# Altium schematic sheet Tiresias_logic.SchDoc: Tiresias Logic
size 393 x 281 mm; Author: João Victor Colombari Carlet; CompanyName: GMETA; DrawnBy: João Victor Colombari Carlet; Organization: GMETA; Address1: EESC - USP; Address2: 400, Trabalhador São-Carlense Av.; Address3: 13566-590, São Carlos; Address4: São Paulo, Brazil; Revision: 1.0; SheetNumber: 2; SheetTotal: 2; Address_Website: http://www.sel.eesc.usp.br/jcarmo/metamaterials/
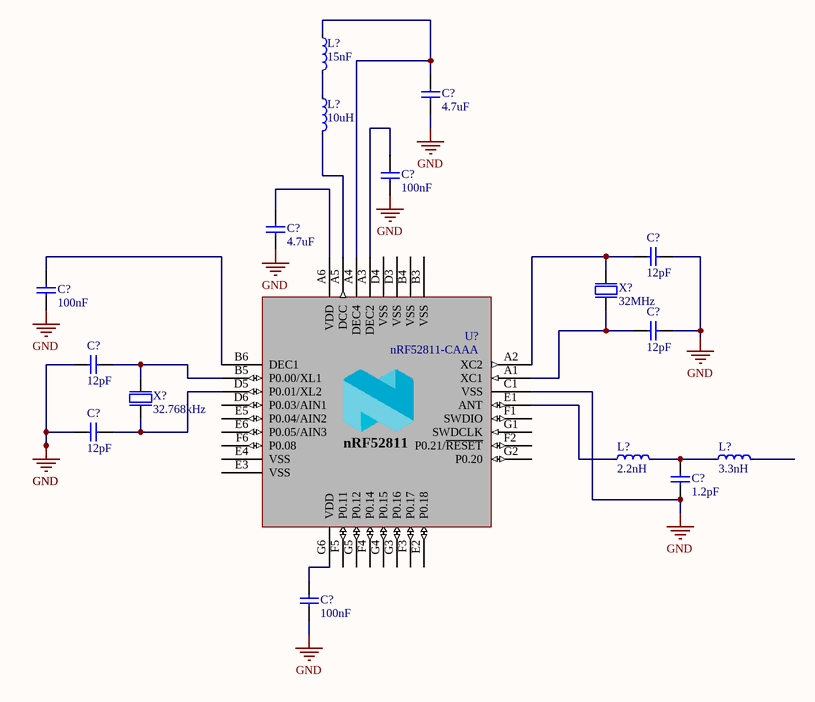
[diagram p0: Tiresias_logic.SchDoc]

## Parts
(Parts that share a designator on the sheet are numbered #1, #2 ... from top to bottom, then left to right.)
C?#1  4.7uF  [CAPC1608X06L]
C?#2  100nF  [CAPC0603X03L_C]
C?#3  4.7uF  [CAPC1608X06L]
C?#4  12pF  [CAPC0603X03L_C]
C?#5  100nF  [CAPC0603X03L_C]
C?#6  12pF  [CAPC0603X03L_C]
C?#7  12pF  [CAPC0603X03L_C]
C?#8  12pF  [CAPC0603X03L_C]
C?#9  1.2pF  [CAPC0603X03L_C]
C?#10  100nF  [CAPC0603X03L_C]
L?#1  15nF  [INDC1005X04L]
L?#2  10uH  [INDC1608X06L]
L?#3  2.2nH  [INDC0603X03L_C]
L?#4  3.3nH  [INDC0603X03L_C]
U?  nRF52811-CAAA  [BGA33C40P6X6_247X246X50]
X?#1  32MHz  [BT-XTAL_2016]
X?#2  32.768kHz  [XTAL_2012]

## Nets
GND: C?#1.2 C?#2.1 C?#3.2 C?#4.2 C?#5.2 C?#6.2 C?#7.1 C?#8.1 C?#9.2 C?#10.2 U?.C1(VSS) X?#1.2(GND) X?#1.4(GND)
NetC?#1_1: C?#1.1 L?#1.1 U?.A4(DEC4)
NetC?#2_2: C?#2.2 U?.A3(DEC2)
NetC?#3_1: C?#3.1 U?.A6(VDD)
NetC?#4_1: C?#4.1 U?.A2(XC2) X?#1.3(out)
NetC?#5_1: C?#5.1 U?.B6(DEC1)
NetC?#6_1: C?#6.1 U?.A1(XC1) X?#1.1(inp)
NetC?#7_2: C?#7.2 U?.B5(P0.00/XL1) X?#2.1(inp)
NetC?#8_2: C?#8.2 U?.D5(P0.01/XL2) X?#2.2(out)
NetC?#9_1: C?#9.1 L?#3.2 L?#4.1
NetC?#10_1: C?#10.1 U?.G6(VDD)
NetL?#1_2: L?#1.2 L?#2.1
NetL?#2_2: L?#2.2 U?.A5(DCC)
NetL?#3_1: L?#3.1 U?.E1(ANT)

Not connected (* = marked no-connect by the designer): L?#4 2; U? B3(VSS) B4(VSS) D3(VSS) D4(VSS) D6(P0.03/AIN1) E2(P0.18) E3(VSS) E4(VSS) E5(P0.04/AIN2) E6(P0.05/AIN3) F1(SWDIO) F2(P0.21/~{RESET}) F3(P0.17) F4(P0.14) F5(P0.11) F6(P0.08) G1(SWDCLK) G2(P0.20) G3(P0.16) G4(P0.15) G5(P0.12)

## Notes on the sheet
- Title:
- Drawn By:
- Size:
- Date:
- File:
- A3
- Number:
- Time:
- Revision:
- Sheet
- of
- Website:
- (in symbol nRF52811_CAAA) nRF52811

## Library data of the parts
C?#1 C?#3 = CAP_0603_4_7uF: Capacitor, X5R, ±10%; Part Number: C0603-4µ7; Class: SMT; Manufacturer: *; Manufacturer Part Number: *; LatestRevisionDate: 2024/02/20; Value: 4.7uF; Package: 0603; Pin Count: 2
C?#2 C?#5 C?#10 = CAP_0201_100nF: Capacitor, NP0, ±2%; Part Number: C0201-100n; Class: SMT; Manufacturer: *; Manufacturer Part Number: *; LatestRevisionDate: 2024/02/20; Value: 100nF; Package: 0201; Pin Count: 2; JLCpcb link: *; Mouser link: *; DigiKey link: *
C?#4 C?#6-C?#8 = CAP_0201_12pF: Capacitor, NP0, ±2%; Part Number: C0201-12p; Class: SMT; Manufacturer: *; Manufacturer Part Number: *; LatestRevisionDate: 2017-11-09; Value: 12pF; Package: 0201; Pin Count: 2; JLCpcb link: *; Mouser link: *; DigiKey link: *
C?#9 = CAP_0201_1p2F: Capacitor, NP0, ±2%; Part Number: C0201-1p2; Class: SMT; Manufacturer: *; Manufacturer Part Number: *; LatestRevisionDate: 2024/02/20; Value: 1.2pF; Package: 0201; Pin Count: 2; JLCpcb link: *; Mouser link: *; DigiKey link: *
L?#1 = IND_0402_15nF: High frequency chip inductor ±10%; Part Number: L0402-15n; Class: SMT; LatestRevisionDate: 2024/02/20; Value: 15nF; Package: 0402; Pin Count: 2
L?#2 = IND_0603_10uH: Chip inductor, IDC,min = 50 mA, ±20%; Part Number: L0603-10µ; Class: SMT; LatestRevisionDate: 2024/02/20; Value: 10uH; Package: 0603; Pin Count: 2
L?#3 = IND_0201_2n2H: High frequency chip inductor ±5%; Part Number: L0201-2n2; Class: SMT; Manufacturer: *; Manufacturer Part Number: *; LatestRevisionDate: 2024/02/20; Value: 2.2nH; Package: 0201; Pin Count: 2
L?#4 = IND_0201_3n3H: High frequency chip inductor ±5%; Part Number: L0201-3n3; Class: SMT; Manufacturer: *; Manufacturer Part Number: *; LatestRevisionDate: 2024/02/20; Value: 3.3nH; Package: 0201; Pin Count: 2
U? = nRF52811_CAAA: Multi-protocol Bluetooth Low Energy, IEEE 802.15.4, ANT and 2.4GHz proprietary system-on-chip; Part Number: nRF52811-CAAAA0; Manufacturer: Nordic Semiconductor; Class: logic; Manufacturer Part Number: nRF52811-CAAAA0; Latest Revision Date: 2024-01-31; Package: WLCSP-33; Pin Count: 33; Value: nRF52811-CAAA; Mouser link: https://br.mouser.com/ProductDetail/Nordic-Semiconductor/nRF52811-CAAA-R7?qs=gZXFycFWdAO63ozaGGh1Bg%3D%3D; DigiKey link: https://www.digikey.com.br/pt/products/detail/nordic-semiconductor-asa/NRF52811-CAAA-R7/13572785?s=N4IgTCBcDaIHYCUBiBWMAOAjJgtAYQEEicEB2EAXQF8g; JLCpcb link: https://jlcpcb.com/partdetail/NordicSemicon-NRF52811_CAAAR7/C3606813
X?#1 = XTAL_SMD2016_32MHz: XTAL SMD 2016, 32MHz, Cl=8pF, Total Tol: ±40ppm; Part Number: XTAL_SMD2016_32MHz_8pF_General; Class: SMT; Manufacturer: *; Manufacturer Part Number: *; LatestRevisionDate: 2024/02/20; Value: 32MHz; Package: 2016; Pin Count: 4
X?#2 = XTAL_SMD2012_32k768Hz: XTAL SMD 2012, 32.768kHz, Cl=9pF, Total Tol: ±50ppm; Part Number: XTAL_SMD2012_32.768kHz_9pF_General; Class: SMT; Manufacturer: *; Manufacturer Part Number: *; LatestRevisionDate: 2024/02/20; Value: 32.768kHz; Package: 2012; Pin Count: 4